# Altium schematic sheet PS_Schematic.SchDoc
size A4; SheetNumber: 1; SheetTotal: 1
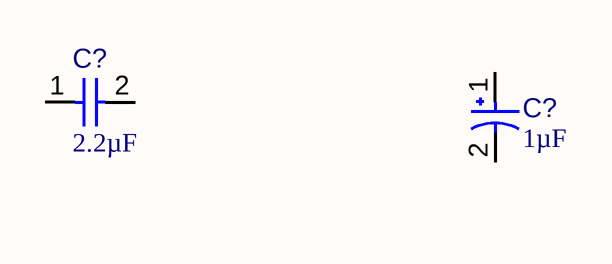
[diagram p0: PS_Schematic.SchDoc]

## Parts
(Parts that share a designator on the sheet are numbered #1, #2 ... from top to bottom, then left to right.)
C?#1  value 1µF  [CAPMP3217X18-T_V]  (hidden comment: TAJA105K035RNJ)
C?#2  value 2.2µF  [CAPC0402(1005)60_L]  (hidden comment: Capacitor 2,2µF +/-20% 10V 0402)

## Nets

Not connected (* = marked no-connect by the designer): C?#1 1 2; C?#2 1 2

## Library data of the parts
C?#1 = CMP-001-00040-7: Standard Tantalum, 1 uF, +/- 10%, 35 V, -55 to 125 degC, 1206 (3216 Metric), RoHS, Tape and Reel; Manufacturer: AVX; Voltage Rating: 35V; ESR: 7.5Ohm; Package Quantity: 2000; Case/Package: 1206; Datasheet Version: Feb-16; Tolerance: 10%; Max Operating Temperature: 125°C; Mounting Technology: SM; Package URL: http://www.avx.com/download/software/literature/AVX-Footprint-Library.pdf; Package Reference: CAPMP3217X18-T; Manufacturer URL: http://www.avx.com/; Min Operating Temperature: -55°C; Pins: 2; RoHS Compliant: True; Packaging: TapeandReel; Resistance: 7.5Ohm; Package Description: 2-Pin Surface Mount Device, Body 3.2 x 1.65 mm; Datasheet URL: http://datasheets.avx.com/TAJ.pdf; Capacitor Type: Tantalum
C?#2 = CMP-001-00056-4: Chip Capacitor, 2,2µF +/-20%, 10V, 0402, Thickness 0.6 mm; Tolerance: 10%; Mounting Technology: SMT; Max Operating Temperature: 85°C; Case/Package: 0402; Pins: 2; Min Operating Temperature: -55°C; Voltage Rating: 10V